# Altium schematic sheet Selector.SchDoc
size A4
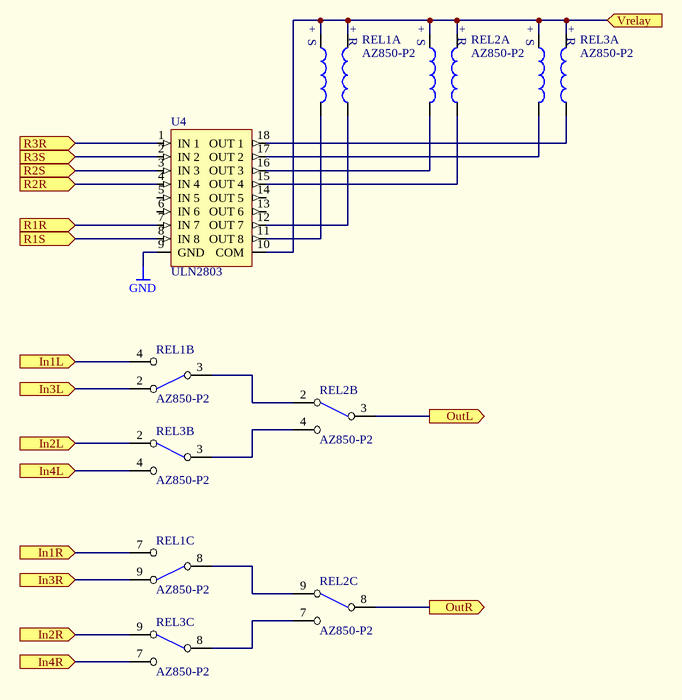
[diagram p0: Selector.SchDoc]

## Parts
REL1  AZ850-P2  [RELAY_AZ850]  (parts A,B,C of 3)
REL2  AZ850-P2  [RELAY_AZ850]  (parts A,B,C of 3)
REL3  AZ850-P2  [RELAY_AZ850]  (parts A,B,C of 3)
U4  ULN2803  [IC_SOIC-18]

## Ports
In1L (in), In1R (in), In2L (in), In2R (in), In3L (in), In3R (in), In4L (in), In4R (in), OutL (out), OutR (out), R1R (in), R1S (in), R2R (in), R2S (in), R3R (in), R3S (in), Vrelay (in)

## Nets
GND: U4.9(GND)
In1L: REL1.4 ; port In1L
In1R: REL1.7 ; port In1R
In2L: REL3.2 ; port In2L
In2R: REL3.9 ; port In2R
In3L: REL1.2 ; port In3L
In3R: REL1.9 ; port In3R
In4L: REL3.4 ; port In4L
In4R: REL3.7 ; port In4R
OutL: REL2.3 ; port OutL
OutR: REL2.8 ; port OutR
R1R: U4.7(IN_7) ; port R1R
R1S: U4.8(IN_8) ; port R1S
R2R: U4.4(IN_4) ; port R2R
R2S: U4.3(IN_3) ; port R2S
R3R: U4.1(IN_1) ; port R3R
R3S: U4.2(IN_2) ; port R3S
Vrelay: REL1.1 REL1.10 REL2.1 REL2.10 REL3.1 REL3.10 U4.10(COM) ; port Vrelay
NetREL1_3: REL1.3 REL2.2
NetREL1_5: REL1.5 U4.11(OUT_8)
NetREL1_6: REL1.6 U4.12(OUT_7)
NetREL1_8: REL1.8 REL2.9
NetREL2_4: REL2.4 REL3.3
NetREL2_5: REL2.5 U4.16(OUT_3)
NetREL2_6: REL2.6 U4.15(OUT_4)
NetREL2_7: REL2.7 REL3.8
NetREL3_5: REL3.5 U4.17(OUT_2)
NetREL3_6: REL3.6 U4.18(OUT_1)

Not connected (* = marked no-connect by the designer): U4 5(IN_5) 6(IN_6) 13(OUT_6) 14(OUT_5)

## Notes on the sheet
- (in symbol AZ850-P2, part A) +; S; R

## Library data of the parts
REL1-REL3 = AZ850-P2: bi-stable relay
U4 = ULN2803: HIGH-VOLTAGE,HIGH-CURRENT DARLINTON ARRAYS